# EAGLE board PKG900000001506 (EAGLE 7.7.0), part 1 of 2
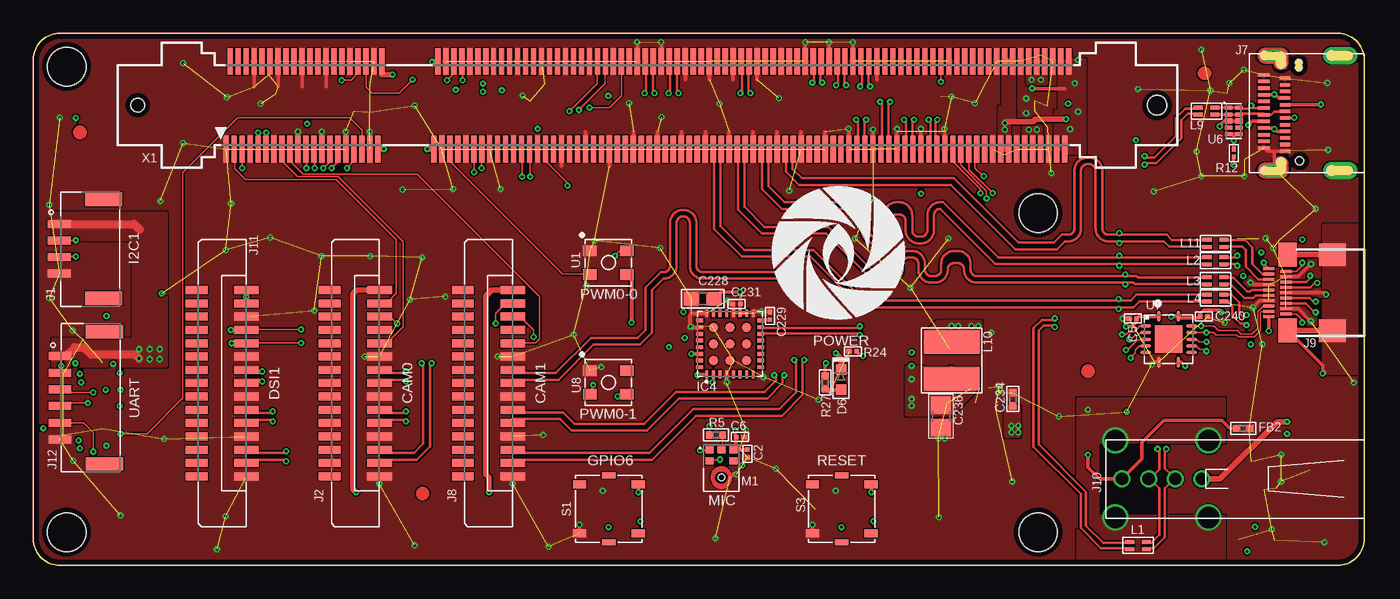
[diagram p18: board, top side]
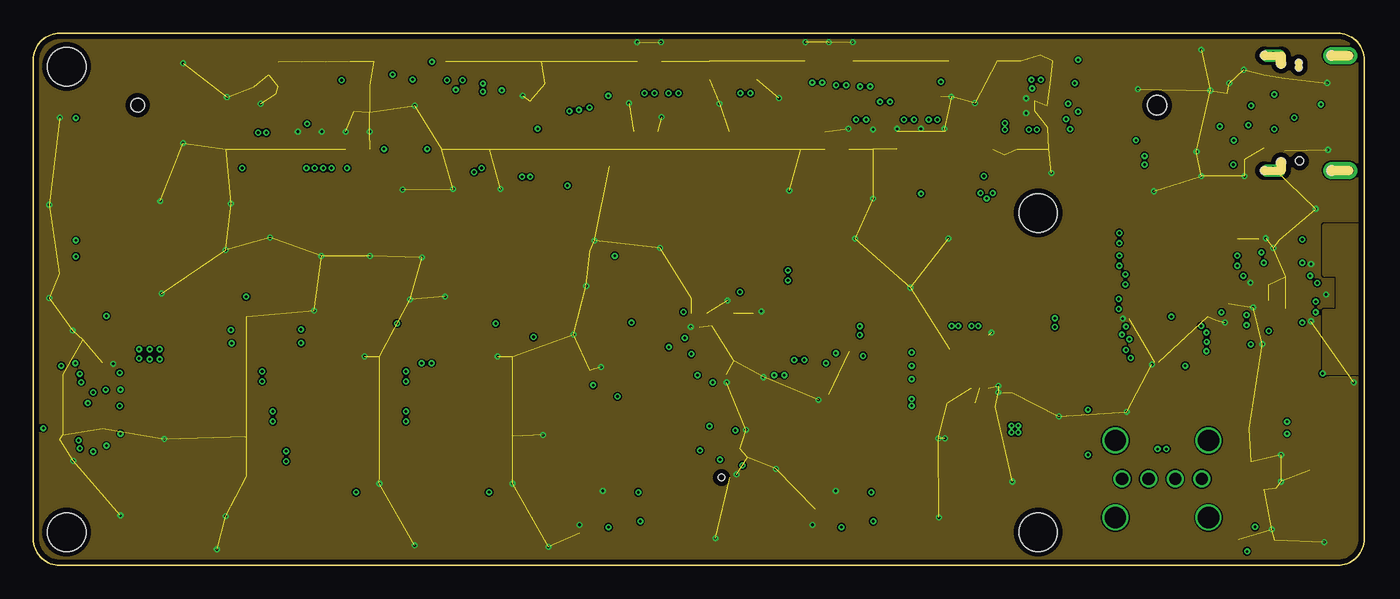
[diagram p19: board, inner layer GND]
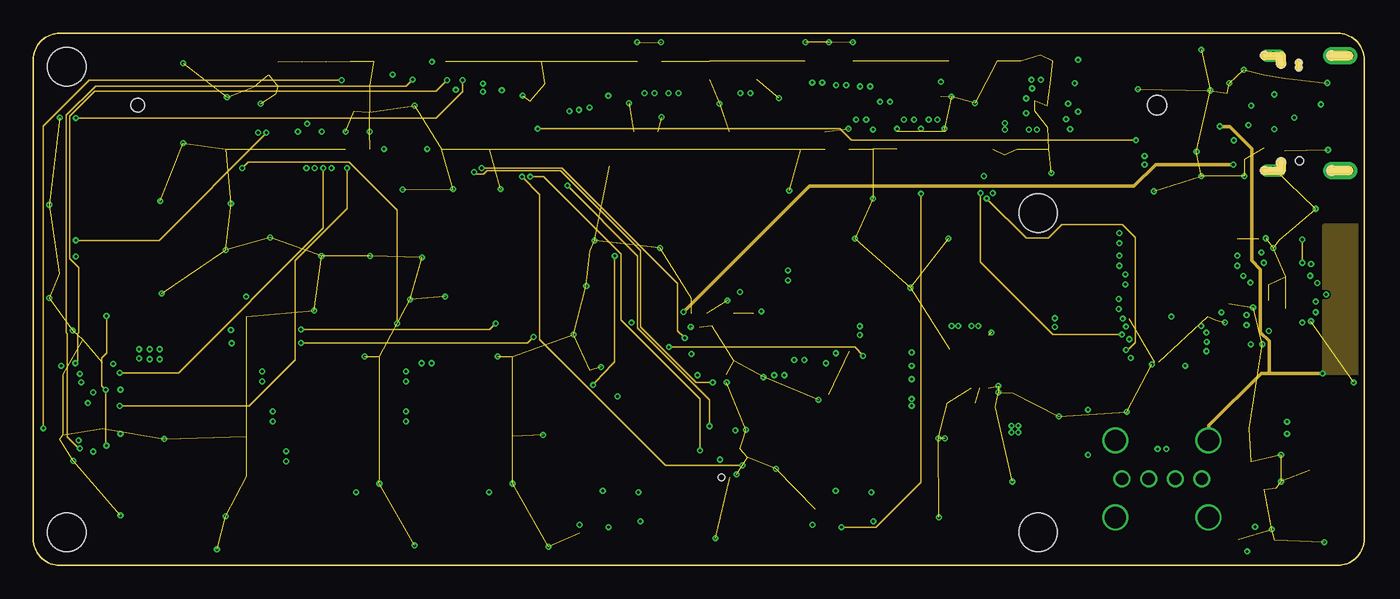
[diagram p20: board, inner layer S3]
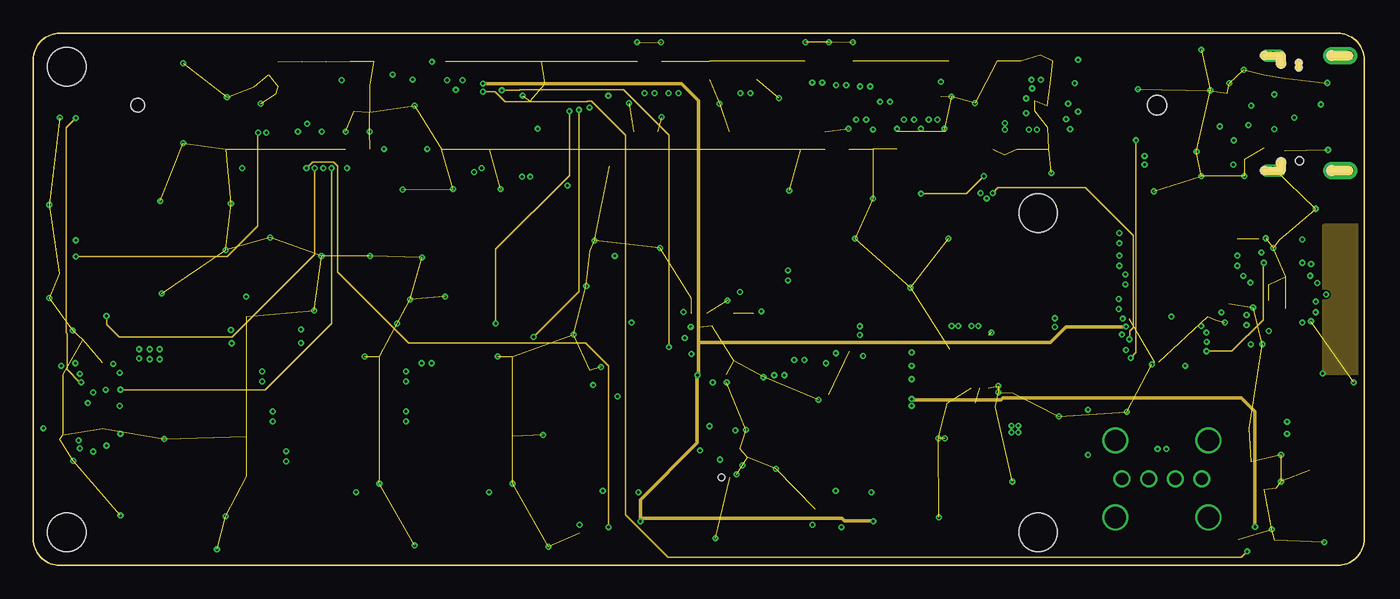
[diagram p21: board, inner layer S14]
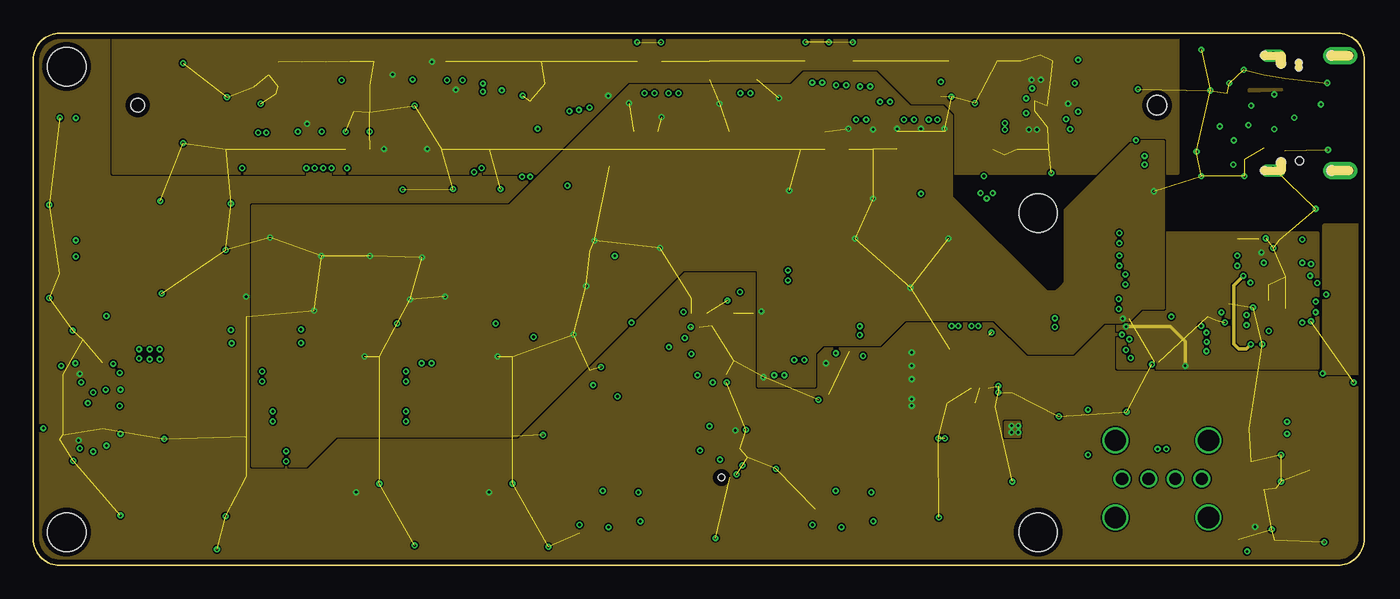
[diagram p22: board, inner layer Power]
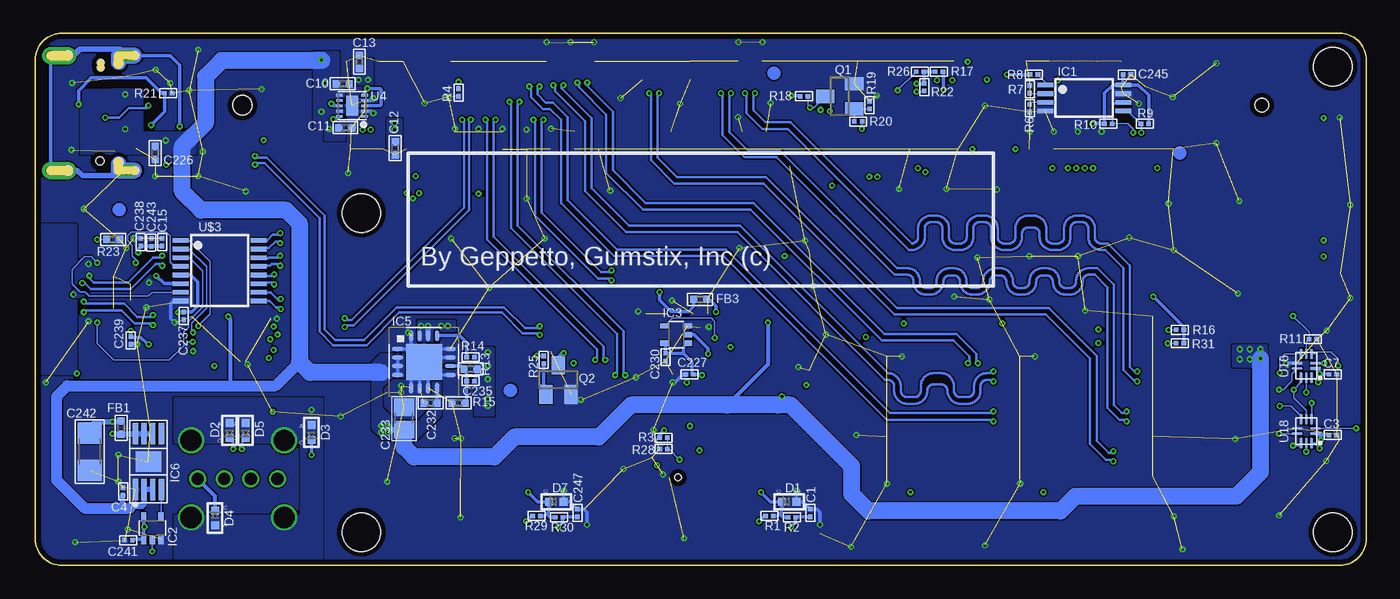
[diagram p23: board, bottom side, seen from below]

Size 100 x 40 mm. Coordinates in mm from the lower left corner, seen from the top.
Outline: 2,0 98,0 arc90 100,2 100,38 arc90 98,40 2,40 arc90 0,38 0,2 arc90 2,0
Copper layers (1+2*3+14*15+16): Top 0.035mm / dielectric 0.2mm / GND 0.035mm / dielectric 0.2mm / S3 0.035mm / dielectric 0.2mm / S14 0.035mm / dielectric 0.2mm / Power 0.035mm / dielectric 0.2mm / Bottom 0.035mm
Design rules "geppetto": minimum track width 4mil, minimum drill 8mil, track to track 4mil, track to pad 0.15mm, pad to pad 0.15mm, via to via 0.15mm, smd to smd 0mil, copper to edge 15mil, drill to drill 10mil, minimum pad ring 7mil, minimum via ring 5mil, stop-mask expansion 3mil, vias tented up to drill 20mil, thermal gap 0mil
Net classes: 1 supply: width 0.254 mm; 2 analog: width 0.178 mm; 4 xxwide: width 0.203 mm; 5 USB: width 0.2 mm, clearance 0.2 mm; 6 HDMI: width 0.2 mm, clearance 0.3 mm; 7 50_OHM: width 0.378 mm, clearance 0.3 mm
vRestrict: area 66,9.5 to 75.5,19

## Footprints (pad centres in the part's own frame; a part is rotated, then mirrored left to right if it is on the bottom)
0201 = smd 0.356 x 0.33: 1 -0.292,0; 2 0.292,0
0402 = smd 0.559 x 0.559: 1 -0.483,0; 2 0.483,0
0603 = smd 1.1 x 1: 1 -0.85,0; 2 0.85,0
0805 = smd 1.3 x 1.5: 1 -0.85,0; 2 0.85,0
1206 = smd 1.6 x 1.8: 1 -1.4,0; 2 1.4,0
D0402 = smd 0.6 x 0.6: P1 0,-0.55; P2 0,0.55
D0603 = smd 0.8 x 0.8: A -0.75,0; C 0.75,0
TSSOP8 = smd 0.35 x 1.2: 1 -0.975,-2.925; 2 -0.325,-2.925; 3 0.325,-2.925; 4 0.975,-2.925; 5 0.975,2.925; 6 0.325,2.925; 7 -0.325,2.925; 8 -0.975,2.925
SC70-5 = smd 0.4 x 0.7: 1 -0.65,-0.85; 2 0,-0.85; 3 0.65,-0.85; 4 0.65,0.85; 5 -0.65,0.85
QFN32 = smd 0.6 x 0.3: 1 -2.3,1.75; 2 -2.3,1.25; 3 -2.3,0.75; 4 -2.3,0.25; 5 -2.3,-0.25; 6 -2.3,-0.75; 7 -2.3,-1.25; 8 -2.3,-1.75; 17 2.3,-1.75; 18 2.3,-1.25; 19 2.3,-0.75; 20 2.3,-0.25; 21 2.3,0.25; 22 2.3,0.75; 23 2.3,1.25; 24 2.3,1.75 | smd 0.3 x 0.6: 9 -1.75,-2.3; 10 -1.25,-2.3; 11 -0.75,-2.3; 12 -0.25,-2.3; 13 0.25,-2.3; 14 0.75,-2.3; 15 1.25,-2.3; 16 1.75,-2.3; 25 1.75,2.3; 26 1.25,2.3; 27 0.75,2.3; 28 0.25,2.3; 29 -0.25,2.3; 30 -0.75,2.3; 31 -1.25,2.3; 32 -1.75,2.3 | smd 0.7 x 0.7: EXP1 -1.25,1.253; EXP2 1.25,1.25; EXP3 -1.25,-1.25; EXP4 1.25,-1.25; EXP5 0,1.25; EXP6 -1.25,0; EXP7 0,0; EXP8 1.25,0; EXP9 0,-1.25
PQFP16 = smd 0.85 x 0.35: 1 -1.975,0.975; 2 -1.975,0.325; 3 -1.975,-0.325; 4 -1.975,-0.975; 9 1.975,-0.975; 10 1.975,-0.325; 11 1.975,0.325; 12 1.975,0.975 | smd 0.35 x 0.85: 5 -0.975,-1.975; 6 -0.325,-1.975; 7 0.325,-1.975; 8 0.975,-1.975; 13 0.975,1.975; 14 0.325,1.975; 15 -0.325,1.975; 16 -0.975,1.975 | smd 2.7 x 2.7: P$1 0,0
MSOP8-PAD = smd 0.4 x 1.6: 1 -0.975,-2.1; 2 -0.325,-2.1; 3 0.325,-2.1; 4 0.975,-2.1; 5 0.975,2.1; 6 0.325,2.1; 7 -0.325,2.1; 8 -0.975,2.1 | smd 1.89 x 1.57: TP 0,0
JST-GH-4V = smd 0.6 x 1.7: P1 1.875,1.95; P2 0.625,1.95; P3 -0.625,1.95; P4 -1.875,1.95 | smd 1 x 2.8: P$1 -3.725,-1.4; P$8 3.725,-1.4
1-1734248-5 = smd 0.6 x 1.85: 1_1 7,0.025; 1_2 6,0.025; 1_3 5,0.025; 1_4 4,0.025; 1_5 3,0.025; 1_6 2,0.025; 1_7 1,0.025; 1_8 0,0.025; 1_9 -1,0.025; 1_10 -2,0.025; 1_11 -3,0.025; 1_12 -4,0.025; 1_13 -5,0.025; 1_14 -6,0.025; 1_15 -7,0.025 | smd 0.6 x 1.65: 2_1 7,-3.725; 2_2 6,-3.725; 2_3 5,-3.725; 2_4 4,-3.725; 2_5 3,-3.725; 2_6 2,-3.725; 2_7 1,-3.725; 2_8 0,-3.725; 2_9 -1,-3.725; 2_10 -2,-3.725; 2_11 -3,-3.725; 2_12 -4,-3.725; 2_13 -5,-3.725; 2_14 -6,-3.725; 2_15 -7,-3.725
USB-TYPE-C-SMT = smd 0.27 x 0.9: A1 -2.625,2.7; A2 -2.125,2.7; A3 -1.625,2.7; A4 -1.125,2.7; A5 -0.625,2.7; A6 -0.125,2.7; A7 0.375,2.7; A8 0.875,2.7; A9 1.375,2.7; A10 1.875,2.7; A11 2.375,2.7; A12 2.875,2.7 | smd 0.27 x 0.8: B1 2.625,1.1; B2 2.125,1.1; B3 1.625,1.1; B4 1.125,1.1; B5 0.625,1.1; B6 0.125,1.1; B7 -0.375,1.1; B8 -0.875,1.1; B9 -1.375,1.1; B10 -1.875,1.1; B11 -2.375,1.1; B12 -2.875,1.1 | drill 0.7 pad 1.3 offset: P$1 -4.32,-3.7; P$3 4.32,-3.7 | drill 0.6 pad 0.813 long: P$2 4.32,2; P$4 -4.32,2 | hole 0.6: -3.6,0; -4.32,2.65; 4.32,2.65 | hole 0.5: 3.425,0.065; 3.775,0.065 | hole 0.7: -4.32,-2.4; 4.32,-2.4; -3.72,1.4; 3.72,1.4
46765-001 = smd 0.23 x 0.85: 1 1.8,7.175; 2 1.6,5.875; 3 1.4,7.175; 4 1.2,5.875; 5 1,7.175; 6 0.8,5.875; 7 0.6,7.175; 8 0.4,5.875; 9 0.2,7.175; 10 0,5.875; 11 -0.2,7.175; 12 -0.4,5.875; 13 -0.6,7.175; 14 -0.8,5.875; 15 -1,7.175; 16 -1.2,5.875; 17 -1.4,7.175; 18 -1.6,5.875; 19 -1.8,7.175 | smd 1.7 x 2: CON1 -2.85,2.4; CON2 2.85,2.4 | smd 1.8 x 1.38: CON3 2.85,5.76; CON4 -2.85,5.76
USB-A-H-RA = drill 0.92: D+ -1,0; D- 1,0; GND -3,0; VBUS 3,0 | drill 1.6: P$1 -3.5,2.9; P$2 3.5,2.9; P$5 -3.5,-2.9; P$6 3.5,-2.9
JST-GH-6V = smd 0.6 x 1.7: P1 3.125,1.95; P2 1.875,1.95; P3 0.625,1.95; P4 -0.625,1.95; P5 -1.875,1.95; P6 -3.125,1.95 | smd 1 x 2.8: P$1 -4.975,-1.4; P$8 4.975,-1.4
0504-DLP11S = smd 0.7 x 0.3: 1 -0.625,0.275; 2 0.625,0.275; 3 0.625,-0.275; 4 -0.625,-0.275
1515 = smd 1.75 x 4.2: 1 -1.375,0; 2 1.375,0
SPH0645 = smd 0.6 x 0.522: 1 -0.9,2.074; 2 -0.9,1.252; 4 0.9,1.252; 5 0.9,2.074; 6 0,2.074 | smd 0.1 x 0.1: 3 0.65,0.02 | hole 0.5: 0,0
SOT23 = smd 1 x 1.4: 1 -0.95,-1.1; 2 0.95,-1.1; 3 0,1.1
EVQ = smd 0.6 x 1: A@1 -1.85,2.2; A@2 -1.85,-2.2; B@1 1.85,2.2; B@2 1.85,-2.2 | smd 0.45 x 1: G@1 -2.525,0; G@2 2.525,0
WS2812B-MINI = smd 1 x 0.8: 1 -1.39,0.89; 2 -1.39,-0.89; 3 1.39,-0.89; 4 1.39,0.89
WFDFN-10 = smd 0.5 x 0.2: 1 -0.95,0.8; 2 -0.95,0.4; 3 -0.95,0; 4 -0.95,-0.4; 5 -0.95,-0.8; 6 0.95,-0.8; 7 0.95,-0.4; 8 0.95,0; 9 0.95,0.4; 10 0.95,0.8 | smd 0.9 x 1.5: PAD 0,0
UFDFN-10 = smd 0.3 x 0.55: 1 -1,-0.385; 2 -0.5,-0.385; 4 0.5,-0.385; 5 1,-0.385; 6 1,0.385; 7 0.5,0.385; 9 -0.5,0.385; 10 -1,0.385 | smd 0.4 x 0.55: 3 0,-0.385; 8 0,0.385
S-PVQFN-N14 = smd 0.85 x 0.28: 1 -1.725,-0.75; 7 1.725,-0.75; 8 1.725,0.75; 14 -1.725,0.75 | smd 0.28 x 0.85: 2 -1,-1.725; 3 -0.5,-1.725; 4 0,-1.725; 5 0.5,-1.725; 6 1,-1.725; 9 1,1.725; 10 0.5,1.725; 11 0,1.725; 12 -0.5,1.725; 13 -1,1.725 | smd 2.05 x 2.05: PAD 0,0
UQFN-10 = smd 0.2 x 0.8: 1 -0.2,-0.7; 2 0.2,-0.7; 6 0.2,0.7; 7 -0.2,0.7 | smd 0.8 x 0.2: 3 0.9,-0.4; 4 0.9,0; 5 0.9,0.4; 8 -0.9,0.4; 9 -0.9,0; 10 -0.9,-0.4
GEPPETTO_HOLE_2.9 = hole 2.9: 0,0
TSSOP16 = smd 1.2 x 0.35: 1 -2.925,2.275; 2 -2.925,1.625; 3 -2.925,0.975; 4 -2.925,0.325; 5 -2.925,-0.325; 6 -2.925,-0.975; 7 -2.925,-1.625; 8 -2.925,-2.275; 9 2.925,-2.275; 10 2.925,-1.625; 11 2.925,-0.975; 12 2.925,-0.325; 13 2.925,0.325; 14 2.925,0.975; 15 2.925,1.625; 16 2.925,2.275
DM-200P = smd 0.4 x 2: 1 -31.65,-3.3; 2 -31.35,3.3; 3 -31.05,-3.3; 4 -30.75,3.3; 5 -30.45,-3.3; 6 -30.15,3.3; 7 -29.85,-3.3; 8 -29.55,3.3; 9 -29.25,-3.3; 10 -28.95,3.3; 11 -28.65,-3.3; 12 -28.35,3.3; 13 -28.05,-3.3; 14 -27.75,3.3; 15 -27.45,-3.3; 16 -27.15,3.3; 17 -26.85,-3.3; 18 -26.55,3.3; 19 -26.25,-3.3; 20 -25.95,3.3; 21 -25.65,-3.3; 22 -25.35,3.3; 23 -25.05,-3.3; 24 -24.75,3.3; 25 -24.45,-3.3; 26 -24.15,3.3; 27 -23.85,-3.3; 28 -23.55,3.3; 29 -23.25,-3.3; 30 -22.95,3.3; 31 -22.65,-3.3; 32 -22.35,3.3; 33 -22.05,-3.3; 34 -21.75,3.3; 35 -21.45,-3.3; 36 -21.15,3.3; 37 -20.85,-3.3; 38 -20.55,3.3; 39 -20.25,-3.3; 40 -19.95,3.3; 41 -16.05,-3.3; 42 -15.75,3.3; 43 -15.45,-3.3; 44 -15.15,3.3; 45 -14.85,-3.3; 46 -14.55,3.3; 47 -14.25,-3.3; 48 -13.95,3.3; 49 -13.65,-3.3; 50 -13.35,3.3; 51 -13.05,-3.3; 52 -12.75,3.3; 53 -12.45,-3.3; 54 -12.15,3.3; 55 -11.85,-3.3; 56 -11.55,3.3; 57 -11.25,-3.3; 58 -10.95,3.3; 59 -10.65,-3.3; 60 -10.35,3.3; 61 -10.05,-3.3; 62 -9.75,3.3; 63 -9.45,-3.3; 64 -9.15,3.3; 65 -8.85,-3.3; 66 -8.55,3.3; 67 -8.25,-3.3; 68 -7.95,3.3; 69 -7.65,-3.3; 70 -7.35,3.3; 71 -7.05,-3.3; 72 -6.75,3.3; 73 -6.45,-3.3; 74 -6.15,3.3; 75 -5.85,-3.3; 76 -5.55,3.3; 77 -5.25,-3.3; 78 -4.95,3.3; 79 -4.65,-3.3; 80 -4.35,3.3; 81 -4.05,-3.3; 82 -3.75,3.3; 83 -3.45,-3.3; 84 -3.15,3.3; 85 -2.85,-3.3; 86 -2.55,3.3; 87 -2.25,-3.3; 88 -1.95,3.3; 89 -1.65,-3.3; 90 -1.35,3.3; 91 -1.05,-3.3; 92 -0.75,3.3; 93 -0.45,-3.3; 94 -0.15,3.3; 95 0.15,-3.3; 96 0.45,3.3; 97 0.75,-3.3; 98 1.05,3.3; 99 1.35,-3.3; 100 1.65,3.3; 101 1.95,-3.3; 102 2.25,3.3; 103 2.55,-3.3; 104 2.85,3.3; 105 3.15,-3.3; 106 3.45,3.3; 107 3.75,-3.3; 108 4.05,3.3; 109 4.35,-3.3; 110 4.65,3.3; 111 4.95,-3.3; 112 5.25,3.3; 113 5.55,-3.3; 114 5.85,3.3; 115 6.15,-3.3; 116 6.45,3.3; 117 6.75,-3.3; 118 7.05,3.3; 119 7.35,-3.3; 120 7.65,3.3; 121 7.95,-3.3; 122 8.25,3.3; 123 8.55,-3.3; 124 8.85,3.3; 125 9.15,-3.3; 126 9.45,3.3; 127 9.75,-3.3; 128 10.05,3.3; 129 10.35,-3.3; 130 10.65,3.3; 131 10.95,-3.3; 132 11.25,3.3; 133 11.55,-3.3; 134 11.85,3.3; 135 12.15,-3.3; 136 12.45,3.3; 137 12.75,-3.3; 138 13.05,3.3; 139 13.35,-3.3; 140 13.65,3.3; 141 13.95,-3.3; 142 14.25,3.3; 143 14.55,-3.3; 144 14.85,3.3; 145 15.15,-3.3; 146 15.45,3.3; 147 15.75,-3.3; 148 16.05,3.3; 149 16.35,-3.3; 150 16.65,3.3; 151 16.95,-3.3; 152 17.25,3.3; 153 17.55,-3.3; 154 17.85,3.3; 155 18.15,-3.3; 156 18.45,3.3; 157 18.75,-3.3; 158 19.05,3.3; 159 19.35,-3.3; 160 19.65,3.3; 161 19.95,-3.3; 162 20.25,3.3; 163 20.55,-3.3; 164 20.85,3.3; 165 21.15,-3.3; 166 21.45,3.3; 167 21.75,-3.3; 168 22.05,3.3; 169 22.35,-3.3; 170 22.65,3.3; 171 22.95,-3.3; 172 23.25,3.3; 173 23.55,-3.3; 174 23.85,3.3; 175 24.15,-3.3; 176 24.45,3.3; 177 24.75,-3.3; 178 25.05,3.3; 179 25.35,-3.3; 180 25.65,3.3; 181 25.95,-3.3; 182 26.25,3.3; 183 26.55,-3.3; 184 26.85,3.3; 185 27.15,-3.3; 186 27.45,3.3; 187 27.75,-3.3; 188 28.05,3.3; 189 28.35,-3.3; 190 28.65,3.3; 191 28.95,-3.3; 192 29.25,3.3; 193 29.55,-3.3; 194 29.85,3.3; 195 30.15,-3.3; 196 30.45,3.3; 197 30.75,-3.3; 198 31.05,3.3; 199 31.35,-3.3; 200 31.65,3.3 | hole 1.45: 38.3,0 | hole 1.05: -38.3,0

## Placement (x,y rotation side)
C1  47pF  [0201]  41.77,3.94 90 bottom
C2  0.1uF  [0201]  53.65,8.4 270 top
C3  0.1uF  [0201]  2.5,9.8 0 bottom
C4  0.1uF  [0201]  93.4,5.55 90 bottom
C5  0.1uF  [0201]  82.6,18.55 180 top
C6  220pF  [0201]  53.1,9.65 0 top
C7  0.1uF  [0201]  2.5,14.35 0 bottom
C10  2.2uF  [0402]  76.9,36.2 0 bottom
C11  2.2uF  [0402]  76.7,32.9 0 bottom
C12  2.2uF  [0402]  72.95,31.35 270 bottom
C13  2.2uF  [0402]  75.65,37.85 90 bottom
C15  0.1uF  [0201]  90.48,24.29 90 bottom
C226  1.0uF  [0402]  90.99,31 270 bottom
C227  0.1uF  [0201]  50.85,14.35 180 bottom
C228  4.7uF  [0603]  50.3,20.05 180 top
C229  0.1uF  [0201]  55.35,18.75 90 top
C230  0.1uF  [0201]  52.65,15.65 270 bottom
C231  0.1uF  [0201]  52.85,19.65 180 top
C232  0.1uF / 16V  [0402]  70.3,12.2 180 bottom
C233  10uF / 16V  [0805]  72.3,11.05 90 bottom
C234  1.0uF  [0402]  73.6,12.5 90 top
C235  10pF  [0201]  67.3,13.85 180 bottom
C236  22uF  [0805]  68.2,11.2 270 top
C237  0.1uF  [0201]  88.85,18.75 270 bottom
C238  0.01uF  [0201]  92.08,24.29 90 bottom
C239  0.1uF  [0201]  92.83,16.9 270 bottom
C240  0.1uF  [0201]  87.95,18.7 0 top
C241  0.1uF  [0201]  93,1.9 180 bottom
C242  220uF/6.3V  [1206]  95.9,8.55 270 bottom
C243  0.01uF  [0201]  91.28,24.29 90 bottom
C245  0.1uF  [0201]  17.98,36.89 0 bottom
C247  47pF  [0201]  59.27,3.94 90 bottom
D1  B72590D50A060  [D0402]  43.36,4.78 90 bottom
D2  PS04LTVA1  [D0402]  85.4,10.15 180 bottom
D3  B72590D50A060  [D0402]  79.25,10 180 bottom
D4  B72590D50A060  [D0402]  86.5,3.55 0 bottom
D5  PS04LTVA1  [D0402]  84.2,10.15 180 bottom
D6  GREEN  [D0603]  60.7,13.95 90 top
D7  B72590D50A060  [D0402]  60.86,4.78 90 bottom
FB1  120R 1A  [0402]  93.55,10.35 90 bottom
FB2  120R 1A  [0402]  90.9,10.3 180 top
FB3  120R 1A  [0402]  50.05,20 180 bottom
FD1  DNP  [FIDUCIAL]  29.25,5.4 0 top
FD2  DNP  [FIDUCIAL]  3.5,32.55 0 top
FD3  DNP  [FIDUCIAL]  79.25,14.6 0 top
FD4  DNP  [FIDUCIAL]  88,37 0 top
FD5  DNP  [FIDUCIAL]  14,31 0 bottom
FD6  DNP  [FIDUCIAL]  64.3,13.15 0 bottom
FD7  DNP  [FIDUCIAL]  93.7,26.75 0 bottom
FD8  DNP  [FIDUCIAL]  44.5,37 0 bottom
IC1  CAT24C256YI-G  [TSSOP8]  21.19,35.13 270 bottom
IC2  SN74LVC1G126DCKR  [SC70-5]  91.2,2.8 0 bottom
IC3  SN74LVC1G126DCKR  [SC70-5]  51.85,17.35 90 bottom
IC4  FT232RQ  [QFN32]  52.35,16.65 90 top
IC5  TPS62111  [PQFP16]  70.8,15.3 0 bottom
IC6  TPS2051  [MSOP8-PAD]  91.5,7.8 0 bottom
J1  JST-GH-4V  [JST-GH-4V]  3.9,23.8 90 top
J2  FPC-15VERT  [1-1734248-5]  26,13.7 270 top
J7  USB-TYPE-C  [USB-TYPE-C-SMT]  95.15,34 90 top
J8  FPC-15VERT  [1-1734248-5]  36,13.7 270 top
J9  HDMIMICRO  [46765-001]  100,20.5 90 top
J10  USB-A-H-RA  [USB-A-H-RA]  84.8,6.5 0 top
J11  FPC-15VERT  [1-1734248-5]  16,13.7 270 top
J12  JST-GH-6V  [JST-GH-6V]  3.95,12.6 90 top
L1  DLP11SN900HL2  [0504-DLP11S]  83,1.5 180 top
L2  DLP11SN900HL2  [0504-DLP11S]  88.83,22.9 180 top
L3  DLP11SN900HL2  [0504-DLP11S]  88.83,21.4 180 top
L4  DLP11SN900HL2  [0504-DLP11S]  88.83,20.1 180 top
L9  DLP11SN900HL2  [0504-DLP11S]  88.15,34.15 180 top
L10  6.8uH  [1515]  69,15.4 270 top
L11  DLP11SN900HL2  [0504-DLP11S]  88.83,24.2 180 top
M1  SPH0645  [SPH0645]  51.7,6.6 0 top
Q1  BSS138  [SOT23]  39.56,35.26 90 bottom
Q2  BSS138  [SOT23]  60.7,13.95 0 bottom
R1  10K 1%  [0201]  44.85,3.72 180 bottom
R2  150R  [0201]  43.16,3.61 0 bottom
R3  DNP  [0201]  52.8,9.6 180 bottom
R4  DNP  [0201]  68.2,35.55 90 bottom
R5  51R1  [0402]  51.3,9.8 0 top
R6  100K 1%  [0201]  25.28,34.36 90 bottom
R7  100K 1%  [0201]  25.28,35.78 270 bottom
R8  100K 1%  [0201]  24.97,36.9 0 bottom
R9  1K5  [0201]  16.64,33.19 0 bottom
R10  1K5  [0201]  19.38,33.19 180 bottom
R11  10K 1%  [0201]  4,17 180 bottom
R12  0R  [0201]  90.2,31 90 top
R13  0R  [0402]  67.3,14.75 0 bottom
R14  1M0  [0201]  67.3,15.65 0 bottom
R15  DNP  [0402]  68.2,12.2 0 bottom
R16  1K5  [0201]  14,17.7 0 bottom
R17  0R  [0201]  32.09,37.11 180 bottom
R18  10K 1%  [0201]  42.24,35.26 180 bottom
R19  10K 1%  [0201]  37.31,34.6 270 bottom
R20  0R  [0201]  38.17,33.37 180 bottom
R21  5K1  [0201]  90,35.5 180 bottom
R22  0R  [0201]  33.2,35.95 270 bottom
R23  75R  [0402]  94.15,24.5 180 bottom
R24  100K 1%  [0201]  61.57,16.09 0 top
R25  1K  [0201]  61.8,15.45 270 bottom
R26  4K7  [0201]  33.53,37.11 0 bottom
R27  600R  [0402]  59.5,13.75 90 top
R28  0R  [0201]  52.8,8.75 0 bottom
R29  10K 1%  [0201]  62.35,3.72 180 bottom
R30  150R  [0201]  60.66,3.61 0 bottom
R31  1K5  [0201]  14,16.7 0 bottom
S1  EVQ  [EVQ]  43.25,4.25 90 top
S3  EVQ  [EVQ]  60.75,4.25 90 top
U1  WS2812B-Mini-V3  [WS2812B-MINI]  43.21,22.75 180 top
U4  TLV751180330PDSQ  [WFDFN-10]  76.2,34.55 180 bottom
U6  TPD4E02B0410-USON  [UFDFN-10]  90.2,33.4 270 top
U7  [S-PVQFN-N14]  85.3,17 270 top
U8  WS2812B-Mini-V3  [WS2812B-MINI]  43.21,13.75 180 top
U16  TS3A5223  [UQFN-10]  4.5,15 90 bottom
U18  TS3A5223  [UQFN-10]  4.5,10.1 90 bottom
U$1  DNP  [GEPPETTO_HOLE_2.9]  75.5,26.5 0 top
U$3  TPD13S523TSSOP  [TSSOP16]  86.15,22.15 0 bottom
U$4  DNP  [GEPPETTO_LABEL]  72,21 0 bottom
U$5  DNP  [GEPPETTO_LOGO_SILK10]  60.5,23.5 0 top
U$41  DNP  [GEPPETTO_HOLE_2.9]  75.5,2.5 0 top
U$43  DNP  [GEPPETTO_HOLE_2.9]  2.5,37.5 0 top
U$45  DNP  [GEPPETTO_HOLE_2.9]  2.5,2.5 0 top
X1  DM-200P-SODIMM  [DM-200P]  46.14,34.59 0 top